# Altium schematic sheet Sheet3.SchDoc: D AMP
size A4; Revision: 1.0; SheetNumber: 3; SheetTotal: 5
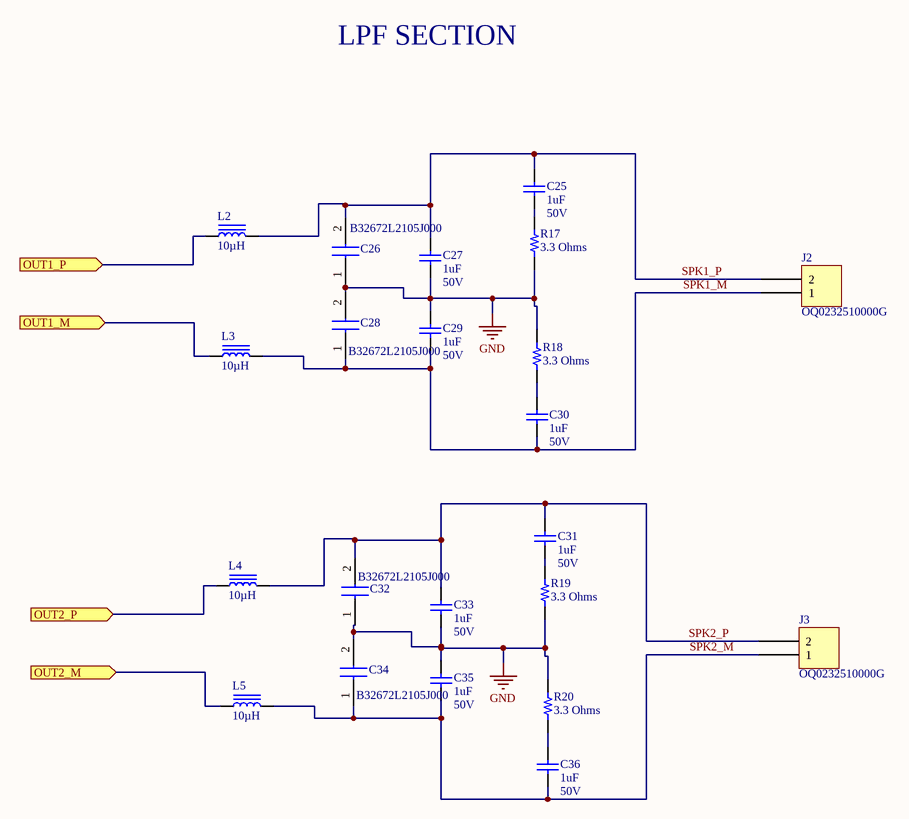
[diagram p0: Sheet3.SchDoc]

## Parts
C25  1uF  VRating: 50V  [C0805]
C26  B32672L2105J000  [B32672L2105J000]
C27  1uF  VRating: 50V  [C0805]
C28  B32672L2105J000  [B32672L2105J000]
C29  1uF  VRating: 50V  [C0805]
C30  1uF  VRating: 50V  [C0805]
C31  1uF  VRating: 50V  [C0805]
C32  B32672L2105J000  [B32672L2105J000]
C33  1uF  VRating: 50V  [C0805]
C34  B32672L2105J000  [B32672L2105J000]
C35  1uF  VRating: 50V  [C0805]
C36  1uF  VRating: 50V  [C0805]
J2  OQ0232510000G  [FCI 06-381-2PIN]
J3  OQ0232510000G  [FCI 06-381-2PIN]
L2  10µH  [TDK SLF12575]
L3  10µH  [TDK SLF12575]
L4  10µH  [TDK SLF12575]
L5  10µH  [TDK SLF12575]
R17  3.3 Ohms  [RES 0805_2012]
R18  3.3 Ohms  [RES 0805_2012]
R19  3.3 Ohms  [RES 0805_2012]
R20  3.3 Ohms  [RES 0805_2012]

## Ports
OUT1_M (in), OUT1_P (in), OUT2_M (in), OUT2_P (in)

## Nets
GND: C26.1 C27.1 C28.2 C29.2 C32.1 C33.1 C34.2 C35.2 R17.1 R18.2 R19.1 R20.2
OUT1_M: L3.1 ; port OUT1_M
OUT1_P: L2.1 ; port OUT1_P
OUT2_M: L5.1 ; port OUT2_M
OUT2_P: L4.1 ; port OUT2_P
SPK1_M: C28.1 C29.1 C30.1 J2.1 L3.2
SPK1_P: C25.2 C26.2 C27.2 J2.2 L2.2
SPK2_M: C34.1 C35.1 C36.1 J3.1 L5.2
SPK2_P: C31.2 C32.2 C33.2 J3.2 L4.2
NetC25_1: C25.1 R17.2
NetC30_2: C30.2 R18.1
NetC31_1: C31.1 R19.2
NetC36_2: C36.2 R20.1

## Notes on the sheet
- LPF SECTION
- Size:
- Date:
- A4
- Author:
- Time:
- Title
- Lovepreet Singh
- Sheet
- Revision:
- of
- File:

## Library data of the parts
C25 C27 C29-C31 C33 C35 C36 = CAP-00145: CAP 1uF 10% 50V X7R 0805; Manufacturer 1: KEMET; Manufacturer 1 PN: C0805C105K5RACTU; SAP PN: 1100016592; Cost Price: 25.55; SMD/TH: SMD; PB-Free: YES; Grade: Commercial; DB Ref: CAP-00145; Life Cycle: Released; Value: 1uF; Tolerence: 10%; ROHS Comp: YES; Operating Temp: -55°C to +105°C
C26 C28 C32 C34 = B32672L2105J000: Capacitor; Manufacturer_Name: TDK; Datasheet Link: https://product.tdk.com/en/search/capacitor/film/mkp_mfp/info?part_no=B32672L2105J000; Height: 18.5mm; Manufacturer_Part_Number: B32672L2105J000; Mouser Part Number: 871-B32672L2105J000; Mouser Price/Stock: https://www.mouser.co.uk/ProductDetail/EPCOS-TDK/B32672L2105J000?qs=W0yvOO0ixfGLW%2FEYLRZvuA%3D%3D
J2 J3 = OQ0232510000G: TERM BLOCK HDR 2POS 90DEG 3.81MM; Manufacturer: Amphenol Anytek; Current - UL: 10A; Header Orientation: 90°, Right Angle; Number of Levels: 1; Number of Positions: 2; Pitch: 0.150" (3.81mm); Voltage - UL: 300V; Part Number: OQ0232510000G; Color: Green; ComponentLink1Description: Datasheet; ComponentLink1URL: http://portal.fciconnect.com/Comergent//fci/drawing/oqxx32x100j0g.pdf; ComponentLink2Description: DigiKey Link; ComponentLink2URL: //digikey.com/product-detail/en/amphenol-anytek/OQ0232510000G/609-3819-ND/2261255; Contact Mating Finish: Tin; LastUpdated: 16-12-2019 07:14:30 PM; Lifecycle Status: 0; Minimum Order: 1; Mounting Type: Through Hole; Operating Temperature: -40°C ~ 115°C; Packaging: Bulk; Part Status: Active; Positions Per Level: 2; Price: 0.49; Series: 06-381; Supplier 1: DigiKey; Supplier Part Number 1: 609-3819-ND; Termination Style: Solder; Type: Header, Male Pins, Shrouded (4 Side)
L2-L5 = SLF12575T-100M5R4-PF: FIXED IND 10UH 5.4A 15.6 MOHM; Manufacturer: TDK Corporation; Current - Saturation: 5.5A; DC Resistance (DCR): 18.7mOhm Max; Inductance Frequency - Test: 1kHz; Material - Core: Ferrite; Shielding: Shielded; Tolerance: ±20%; Type: Wirewound; Part Number: SLF12575T-100M5R4-PF; ComponentLink1Description: Datasheet; ComponentLink1URL: https://product.tdk.com/info/en/catalog/datasheets/inductor_commercial_power_slf12575_en.pdf?ref_disty=digikey; ComponentLink2Description: DigiKey Link; ComponentLink2URL: http://digikey.com/product-detail/en/tdk-corporation/SLF12575T-100M5R4-PF/445-174408-1-ND/5880182; Current Rating (Amps): 5.4A; Device Package: Nonstandard; Height - Seated (Max): 0.309" (7.85mm); Inductance: 10µH; LastUpdated: 02-09-2020 01:22:14 AM; Lifecycle Status: Active; Minimum Order: 1; Mounting Type: Surface Mount; Operating Temperature: -40°C ~ 105°C; Package / Case: Nonstandard; Packaging: TapeAndReel; PartId: 135; Part Status: Active; Price: 0.94; Series: SLF; Size / Dimension: 0.492" L x 0.492" W (12.50mm x 12.50mm); Supplier 1: DigiKey; Supplier Part Number 1: 445-174408-1-ND; Value: 10µH
R17-R20 = CRCW08053R30FKEAHP: RES SMD 3.3 OHM 1% 1/2W 0805; Manufacturer: Vishay Dale; Power (Watts): 0.5W, 1/2W; Temperature Coefficient: ±100ppm/°C; Part Number: CRCW08053R30FKEAHP; Value: 3.3 Ohms; ComponentLink1Description: Datasheet; ComponentLink1URL: http://www.vishay.com/docs/20043/crcwhpe3.pdf; ComponentLink2Description: DigiKey Link; ComponentLink2URL: http://digikey.com/product-detail/en/vishay-dale/CRCW08053R30FKEAHP/541-3.30TCT-ND/5326912; Composition: Thick Film; Device Package: 0805 (2012 Metric); Features: Automotive AEC-Q200, Pulse Withstanding; Height - Seated (Max): 0.020" (0.50mm); LastUpdated: 02-09-2020 01:15:22 AM; Lifecycle Status: Active; Minimum Order: 1; Number of Terminations: 2; Operating Temperature: -55°C ~ 155°C; Package / Case: 0805 (2012 Metric); Packaging: TapeAndReel; PartId: 28521; Part Status: Active; Price: 0.04; Ratings: AEC-Q200; Resistance: 3.3 Ohms; Series: CRCW-HP; Size / Dimension: 0.079" L x 0.049" W (2.00mm x 1.25mm); Supplier 1: DigiKey; Supplier Part Number 1: 541-3.30TCT-ND; Supplier Device Package: 0805; Tolerance: ±1%